# Altium project Room04.PrjPCB
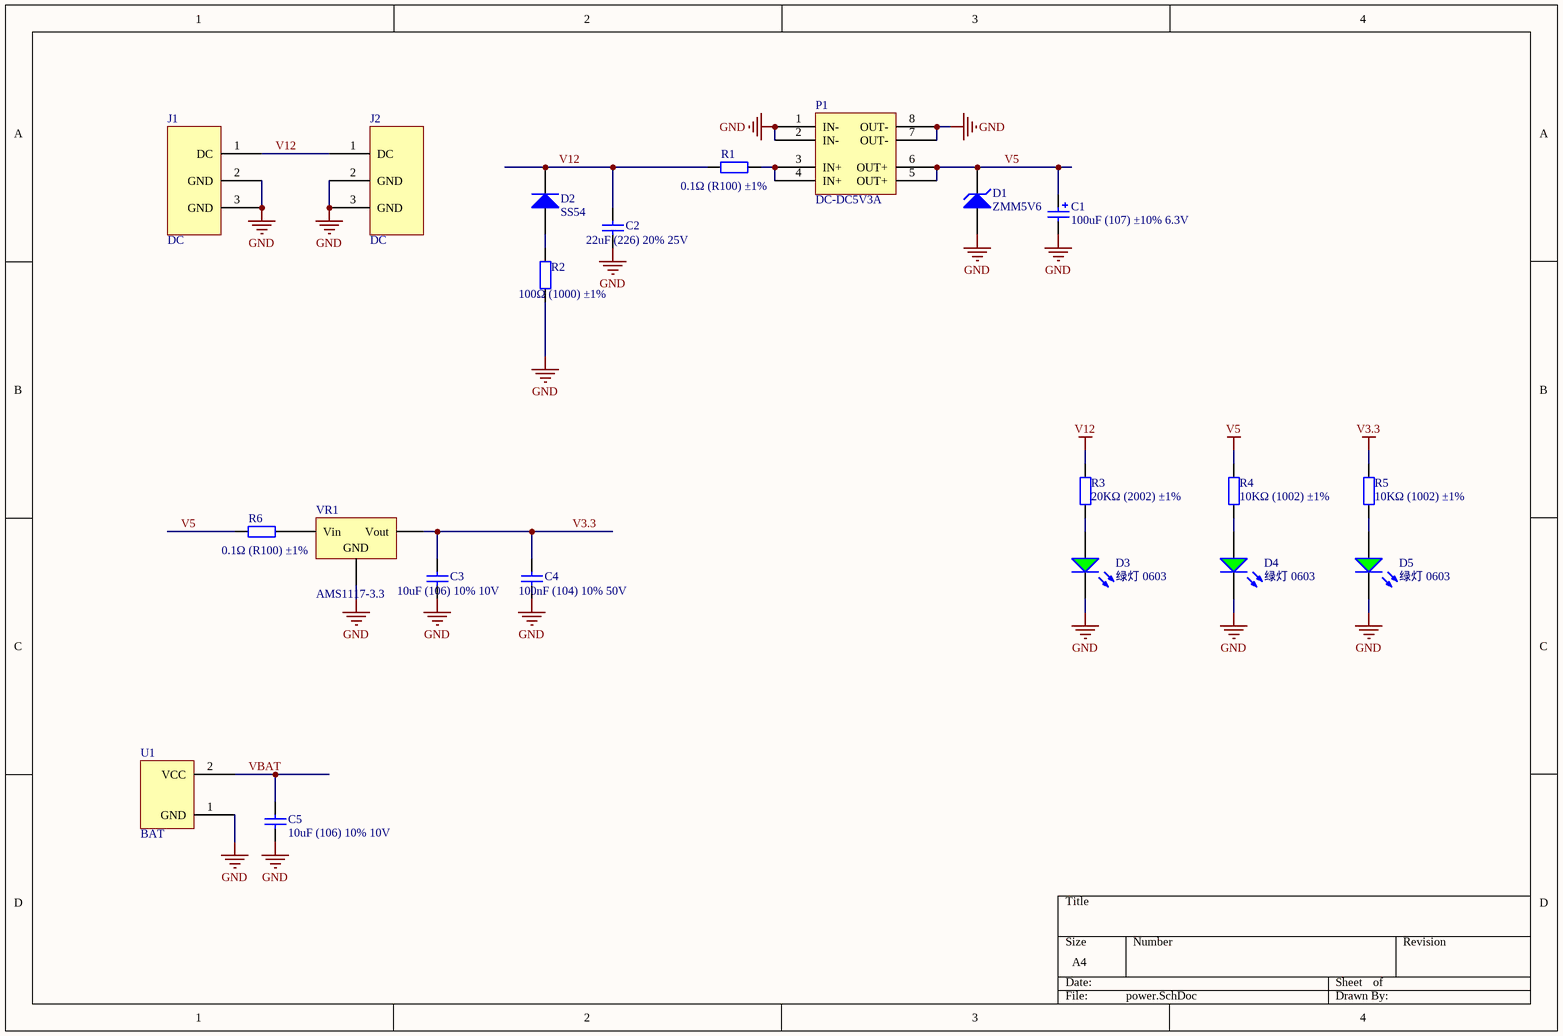
[diagram p0: power.SchDoc]
5 sheets, 100 parts. Net scope: global (net labels, ports and power ports of the same name join across sheets).
Board file: Room04.PcbDoc
Sheets:
  power.SchDoc
  raspi.SchDoc
  commu.SchDoc
  mcu.SchDoc
  other.SchDoc

## Sheet power.SchDoc
size A4

### Parts
C1  100uF (107) ±10% 6.3V  [CASE-B_3528]
C2  22uF (226) 20% 25V  [0805_C]
C3  10uF (106) 10% 10V  [0603_C]
C4  100nF (104) 10% 50V  [0603_C]
C5  10uF (106) 10% 10V  [0603_C]
D1  ZMM5V6  [LL-34]
D2  SS54  [SMA(DO-214AC)_S1]
D3  绿灯 0603  [0603_LED_S1]
D4  绿灯 0603  [0603_LED_S1]
D5  绿灯 0603  [0603_LED_S1]
J1  DC  [DC005]
J2  DC  [DC005]
P1  DC-DC5V3A  [DC-DC3A]
R1  0.1Ω (R100) ±1%  [1206_R]
R2  100Ω (1000) ±1%  [0805_R]
R3  20KΩ (2002) ±1%  [0603_R]
R4  10KΩ (1002) ±1%  [0603_R]
R5  10KΩ (1002) ±1%  [0603_R]
R6  0.1Ω (R100) ±1%  [1206_R]
U1  BAT  [BAT2032]
VR1  AMS1117-3.3  [SOT-223]

### Nets
GND: C1.2 C2.1 C3.1 C4.1 C5.1 D1.1(A) D3.K D4.K D5.K J1.2(GND) J1.3(GND) J2.2(GND) J2.3(GND) P1.1(IN-) P1.2(IN-) P1.7(OUT-) P1.8(OUT-) R2.1 U1.1(GND) VR1.1(GND)
V3.3: C3.2 C4.2 R5.2 VR1.2(Vout)
V5: C1.1 D1.2(K) P1.5(OUT+) P1.6(OUT+) R4.2 R6.1
V12: C2.2 D2.2(K) J1.1(DC) J2.1(DC) R1.1 R3.2
VBAT: C5.2 U1.2(VCC)
NetD2_1: D2.1(A) R2.2
NetD3_A: D3.A R3.1
NetD4_A: D4.A R4.1
NetD5_A: D5.A R5.1
NetP1_3: P1.3(IN+) P1.4(IN+) R1.2
NetR6_2: R6.2 VR1.3(Vin)

### Library data of the parts
C1 = 3528 100uF (107) 10% 6.3V: 钽电容; ComponentLink1Description: 供应商链接; ComponentLink1URL: http://www.szlcsc.com/product/details_16815.html; Package: 3528; Supplier: LC; SuppliersPartNumber: C16133
C2 = 0805 22uF (226) 20% 25V: 贴片电容; ComponentLink1Description: 供应商链接; ComponentLink1URL: http://www.szlcsc.com/product/details_46786.html; Package: 0805; Supplier: LC; SuppliersPartNumber: C45783
C3 C5 = 0603 10uF (106) 10% 10V: 贴片电容; ComponentLink1Description: 供应商链接; ComponentLink1URL: http://www.szlcsc.com/product/details_20411.html; Package: 0603; Supplier: LC; SuppliersPartNumber: C19702
C4 = 0603 100nF (104) 10% 50V: 贴片电容; ComponentLink1Description: 供应商链接; ComponentLink1URL: http://www.szlcsc.com/product/details_15331.html; Package: 0603; Supplier: LC; SuppliersPartNumber: C14663
D1 = LL-34 ZMM5V6: 稳压二极管; ComponentLink1Description: 供应商链接; ComponentLink1URL: http://www.szlcsc.com/product/details_8541.html; Package: LL-34; Supplier: LC; SuppliersPartNumber: C8062
D2 = SMA(DO-214AC) SS54: 二极管; ComponentLink1Description: 供应商链接; ComponentLink1URL: http://www.szlcsc.com/product/details_23178.html; Package: SMA(DO-214AC); Supplier: LC; SuppliersPartNumber: C22452
D3-D5 = 0603 绿灯: 发光二极管; ComponentLink1Description: 供应商链接; ComponentLink1URL: http://www.szlcsc.com/product/details_73152.html; Package: 0603; Supplier: LC; SuppliersPartNumber: C72043
J1 J2 = DC: Connector for DC 12V
P1 = DC-DC3A
R1 R6 = 1206 0.1Ω (R100) 1%: 贴片电阻; ComponentLink1Description: 供应商链接; ComponentLink1URL: http://www.szlcsc.com/product/details_26077.html; Package: 1206; Supplier: LC; SuppliersPartNumber: C25334
R2 = 0805 100Ω (1000) 1%: 贴片电阻; ComponentLink1Description: 供应商链接; ComponentLink1URL: http://www.szlcsc.com/product/details_18096.html; Package: 0805; Supplier: LC; SuppliersPartNumber: C17408
R3 = 0603 20KΩ (2002) 1%: 贴片电阻; ComponentLink1Description: 供应商链接; ComponentLink1URL: http://www.szlcsc.com/product/details_4591.html; Package: 0603; Supplier: LC; SuppliersPartNumber: C4184
R4 R5 = 0603 10KΩ (1002) 1%: 贴片电阻; ComponentLink1Description: 供应商链接; ComponentLink1URL: http://www.szlcsc.com/product/details_26547.html; Package: 0603; Supplier: LC; SuppliersPartNumber: C25804
U1 = BAT2032
VR1 = SOT-223 AMS1117-3.3: 低压差线性稳压(LDO); ComponentLink1Description: 供应商链接; ComponentLink1URL: http://www.szlcsc.com/product/details_6652.html; Package: SOT-223; Supplier: LC; SuppliersPartNumber: C6186

## Sheet raspi.SchDoc
size A4
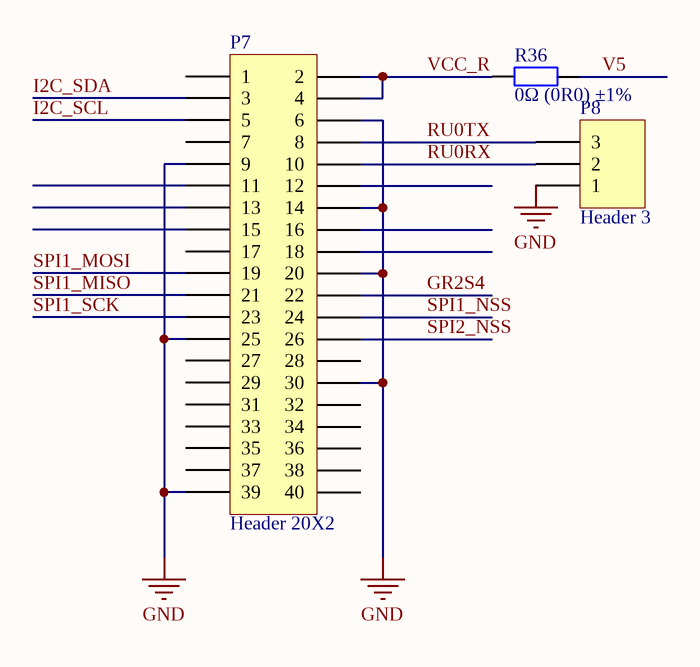
[diagram p1: raspi.SchDoc]

### Parts
P7  Header 20X2  [HDR2X20]
P8  Header 3  [HDR1X3]
R36  0Ω (0R0) ±1%  [1206_R]

### Nets
GND: P7.6 P7.9 P7.14 P7.20 P7.25 P7.30 P7.39 P8.1
V5: R36.2
GR2S4: P7.22
I2C_SCL: P7.5
I2C_SDA: P7.3
RU0RX: P7.10 P8.2
RU0TX: P7.8 P8.3
SPI1_MISO: P7.21
SPI1_MOSI: P7.19
SPI1_NSS: P7.24
SPI1_SCK: P7.23
SPI2_NSS: P7.26
VCC_R: P7.2 P7.4 R36.1

Not connected (* = marked no-connect by the designer): P7 1 7 11 12 13 15 16 17 18 27 28 29 31 32 33 34 35 36 37 38 40

### Library data of the parts
P7 = Header 20X2: Header, 20-Pin, Dual row; LatestRevisionDate: 17-Jul-2002; LatestRevisionNote: Re-released for DXP Platform.; Publisher: Altium Limited
P8 = Header 3: Header, 3-Pin; LatestRevisionDate: 17-Jul-2002; LatestRevisionNote: Re-released for DXP Platform.; Publisher: Altium Limited
R36 = 1206 0Ω (0R0) 1%: 贴片电阻; ComponentLink1Description: 供应商链接; ComponentLink1URL: http://www.szlcsc.com/product/details_18576.html; Package: 1206; Supplier: LC; SuppliersPartNumber: C17888

## Sheet commu.SchDoc
size A4
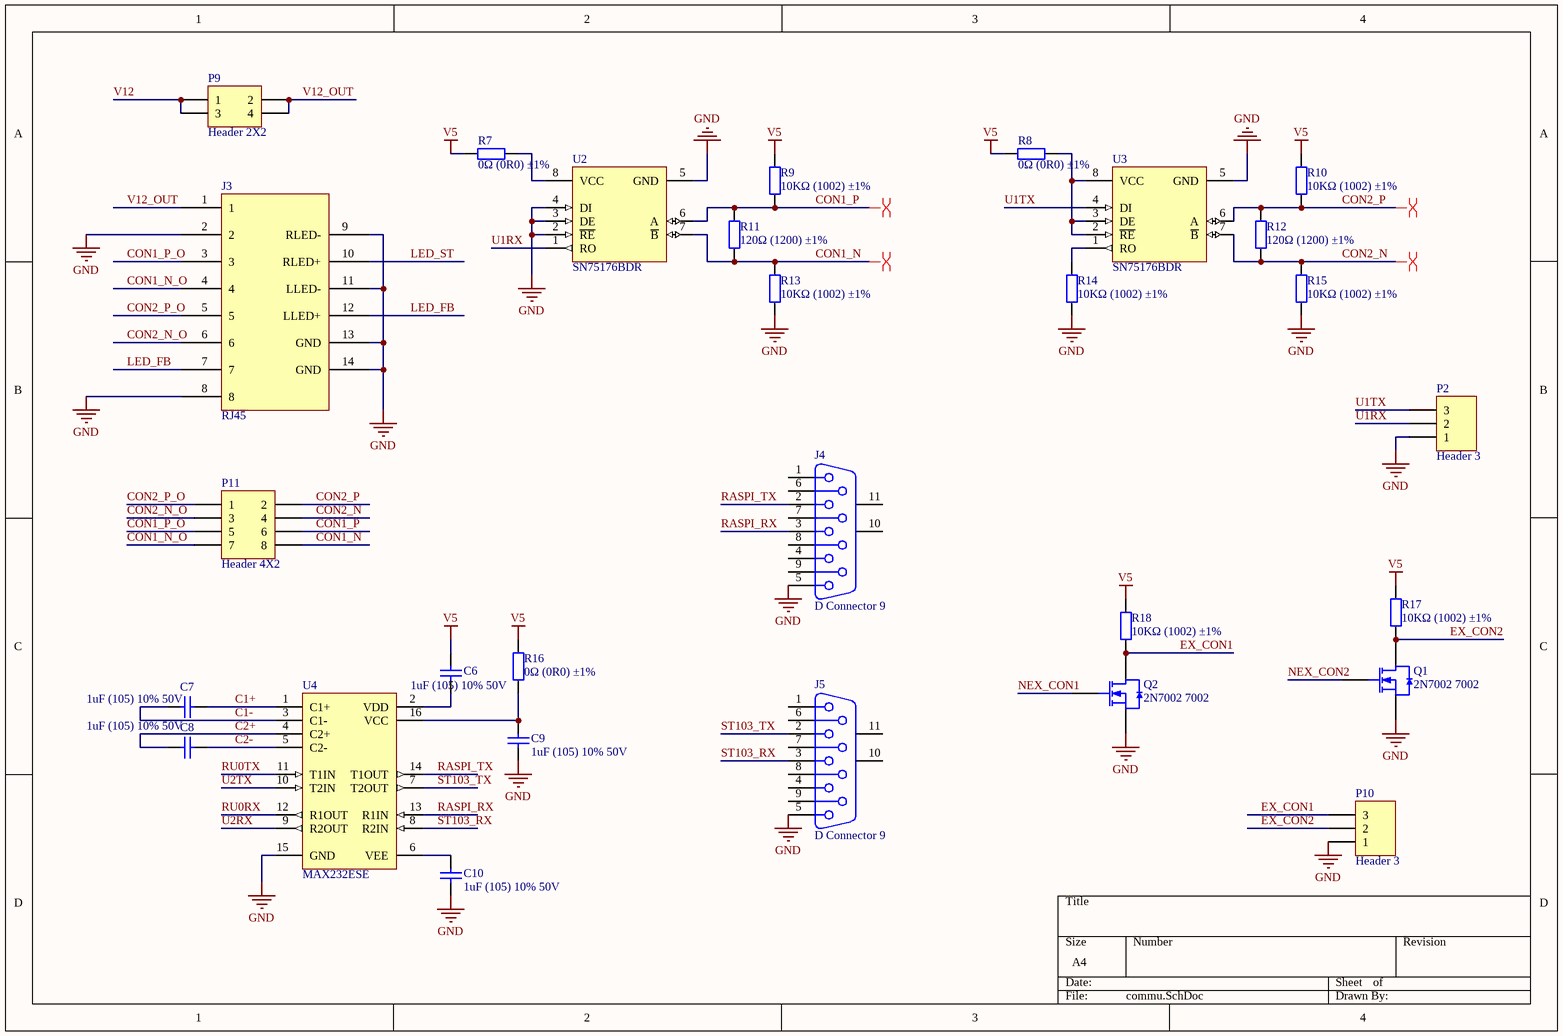
[diagram p2: commu.SchDoc]

### Parts
C6  1uF (105) 10% 50V  [0603_C]
C7  1uF (105) 10% 50V  [0603_C]
C8  1uF (105) 10% 50V  [0603_C]
C9  1uF (105) 10% 50V  [0603_C]
C10  1uF (105) 10% 50V  [0603_C]
J3  RJ45  [RJ45_1]
J4  D Connector 9  [DSUB1.385-2H9]
J5  D Connector 9  [DSUB1.385-2H9]
P2  Header 3  [HDR1X3]
P9  Header 2X2  [HDR2X2]
P10  Header 3  [HDR1X3]
P11  Header 4X2  [HDR2X4]
Q1  2N7002 7002  [SOT-23(SOT-23-3)]
Q2  2N7002 7002  [SOT-23(SOT-23-3)]
R7  0Ω (0R0) ±1%  [1206_R]
R8  0Ω (0R0) ±1%  [1206_R]
R9  10KΩ (1002) ±1%  [0603_R]
R10  10KΩ (1002) ±1%  [0603_R]
R11  120Ω (1200) ±1%  [0603_R]
R12  120Ω (1200) ±1%  [0603_R]
R13  10KΩ (1002) ±1%  [0603_R]
R14  10KΩ (1002) ±1%  [0603_R]
R15  10KΩ (1002) ±1%  [0603_R]
R16  0Ω (0R0) ±1%  [1206_R]
R17  10KΩ (1002) ±1%  [0603_R]
R18  10KΩ (1002) ±1%  [0603_R]
U2  SN75176BDR  [SOIC-8_150mil]
U3  SN75176BDR  [SOIC-8_150mil]
U4  MAX232ESE  [SOIC-16_150mil]

### Nets
GND: C9.1 C10.1 J3.2 J3.8 J3.9(RLED-) J3.11(LLED-) J3.13(GND) J3.14(GND) J4.5 J5.5 P2.1 P10.1 Q1.2(S) Q2.2(S) R13.1 R14.1 R15.1 U2.2(~{RE}) U2.3(DE) U2.4(DI) U2.5(GND) U3.5(GND) U4.15(GND)
V5: C6.2 R7.1 R8.1 R9.2 R10.2 R16.2 R17.2 R18.2
V12: P9.1 P9.3
C1+: C7.2 U4.1(C1+)
C1-: C7.1 U4.3(C1-)
C2+: C8.1 U4.4(C2+)
C2-: C8.2 U4.5(C2-)
CON1_N: P11.8 R11.1 R13.2 U2.7(~{B})
CON1_N_O: J3.4 P11.7
CON1_P: P11.6 R9.1 R11.2 U2.6(A)
CON1_P_O: J3.3 P11.5
CON2_N: P11.4 R12.1 R15.2 U3.7(~{B})
CON2_N_O: J3.6 P11.3
CON2_P: P11.2 R10.1 R12.2 U3.6(A)
CON2_P_O: J3.5 P11.1
EX_CON1: P10.3 Q2.3(D) R18.1
EX_CON2: P10.2 Q1.3(D) R17.1
LED_FB: J3.7 J3.12(LLED+)
LED_ST: J3.10(RLED+)
NEX_CON1: Q2.1(G)
NEX_CON2: Q1.1(G)
RASPI_RX: J4.3 U4.13(R1IN)
RASPI_TX: J4.2 U4.14(T1OUT)
RU0RX: U4.12(R1OUT)
RU0TX: U4.11(T1IN)
ST103_RX: J5.3 U4.8(R2IN)
ST103_TX: J5.2 U4.7(T2OUT)
U1RX: P2.2 U2.1(RO)
U1TX: P2.3 U3.4(DI)
U2RX: U4.9(R2OUT)
U2TX: U4.10(T2IN)
V12_OUT: J3.1 P9.2 P9.4
NetC6_1: C6.1 U4.2(VDD)
NetC9_2: C9.2 R16.1 U4.16(VCC)
NetC10_2: C10.2 U4.6(VEE)
NetR7_2: R7.2 U2.8(VCC)
NetR8_2: R8.2 U3.2(~{RE}) U3.3(DE) U3.8(VCC)
NetR14_2: R14.2 U3.1(RO)

Not connected (* = marked no-connect by the designer): J4 1 4 6 7 8 9 10(MH1) 11(MH2); J5 1 4 6 7 8 9 10(MH1) 11(MH2)

### Layout directives
differential pair: CON1_N, CON1_P, CON2_N, CON2_P

### Library data of the parts
C6-C10 = 0603 1uF (105) 10% 50V: 贴片电容; ComponentLink1Description: 供应商链接; ComponentLink1URL: http://www.szlcsc.com/product/details_16531.html; Package: 0603; Supplier: LC; SuppliersPartNumber: C15849
J3 = RJ45_1
J4 J5 = D Connector 9: Receptacle Assembly, 9 Position, Right Angle; PackageDocument: O; Positions: 9; Published: 15-Jun-2001; LatestRevisionDate: 17-Jul-2002; LatestRevisionNote: Re-released for DXP Platform.; DatasheetDocument: 1-Sep-1999; PackageReference: 788750; Publisher: Altium Limited; Orientation: Right Angle; Gender: Receptacle
P2 P10 = Header 3: Header, 3-Pin; LatestRevisionDate: 17-Jul-2002; LatestRevisionNote: Re-released for DXP Platform.; Publisher: Altium Limited
P9 = Header 2X2: Header, 2-Pin, Dual row; LatestRevisionDate: 17-Jul-2002; LatestRevisionNote: Re-released for DXP Platform.; Publisher: Altium Limited
P11 = Header 4X2: Header, 4-Pin, Dual row; LatestRevisionDate: 17-Jul-2002; LatestRevisionNote: Re-released for DXP Platform.; Publisher: Altium Limited
Q1 Q2 = 2N7002 7002: MOS(场效应管); ComponentLink1Description: 供应商链接; ComponentLink1URL: http://www.szlcsc.com/product/details_9040.html; Package: SOT-23(SOT-23-3); Supplier: LC; SuppliersPartNumber: C8545
R7 R8 R16 = 1206 0Ω (0R0) 1%: 贴片电阻; ComponentLink1Description: 供应商链接; ComponentLink1URL: http://www.szlcsc.com/product/details_18576.html; Package: 1206; Supplier: LC; SuppliersPartNumber: C17888
R9 R10 R13-R15 R17 R18 = 0603 10KΩ (1002) 1%: 贴片电阻; ComponentLink1Description: 供应商链接; ComponentLink1URL: http://www.szlcsc.com/product/details_26547.html; Package: 0603; Supplier: LC; SuppliersPartNumber: C25804
R11 R12 = 0603 120Ω (1200) 1%: 贴片电阻; ComponentLink1Description: 供应商链接; ComponentLink1URL: http://www.szlcsc.com/product/details_23514.html; Package: 0603; Supplier: LC; SuppliersPartNumber: C22787
U2 U3 = SN75176BDR_[C7063]: RS-485/RS-422; ComponentLink1Description: 供应商链接; ComponentLink1URL: http://www.szlcsc.com/product/details_7535.html; Package: SOIC-8_150mil; Supplier: LC; SuppliersPartNumber: C7063
U4 = MAX232ESE_[C26860]: RS232; ComponentLink1Description: 供应商链接; ComponentLink1URL: http://www.szlcsc.com/product/details_27608.html; Package: SOIC-16_150mil; Supplier: LC; SuppliersPartNumber: C26860

## Sheet mcu.SchDoc
size A4
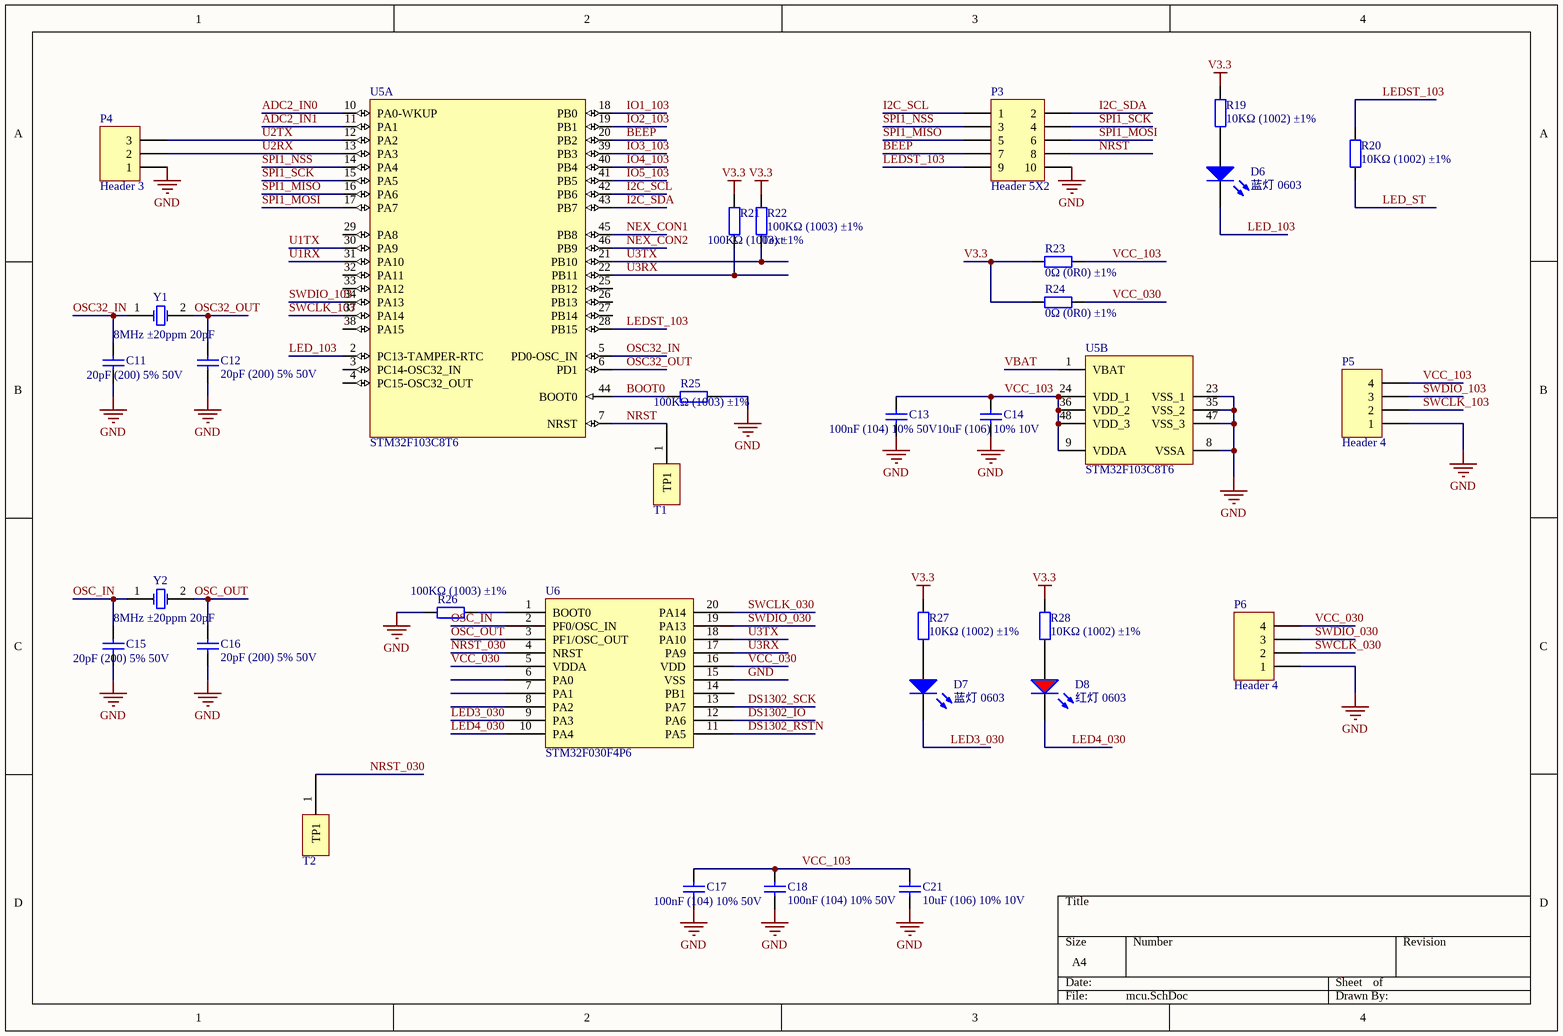
[diagram p3: mcu.SchDoc]

### Parts
C11  20pF (200) 5% 50V  [0603_C]
C12  20pF (200) 5% 50V  [0603_C]
C13  100nF (104) 10% 50V  [0603_C]
C14  10uF (106) 10% 10V  [0603_C]
C15  20pF (200) 5% 50V  [0603_C]
C16  20pF (200) 5% 50V  [0603_C]
C17  100nF (104) 10% 50V  [1206_C]
C18  100nF (104) 10% 50V  [1206_C]
C21  10uF (106) 10% 10V  [0603_C]
D6  蓝灯 0603  [0603_LED_S1]
D7  蓝灯 0603  [0603_LED_S1]
D8  红灯 0603  [0603_LED_S1]
P3  Header 5X2  [HDR2X5]
P4  Header 3  [HDR1X3]
P5  Header 4  [HDR1X4]
P6  Header 4  [HDR1X4]
R19  10KΩ (1002) ±1%  [0603_R]
R20  10KΩ (1002) ±1%  [0603_R]
R21  100KΩ (1003) ±1%  [0603_R]
R22  100KΩ (1003) ±1%  [0603_R]
R23  0Ω (0R0) ±1%  [1206_R]
R24  0Ω (0R0) ±1%  [1206_R]
R25  100KΩ (1003) ±1%  [0603_R]
R26  100KΩ (1003) ±1%  [0603_R]
R27  10KΩ (1002) ±1%  [0603_R]
R28  10KΩ (1002) ±1%  [0603_R]
T1  TP1  [TP1]  (value not drawn)
T2  TP1  [TP1]  (value not drawn)
U5  STM32F103C8T6  [LQFP-48_7x7x05P]  (parts A,B of 2)
U6  STM32F030F4P6  [TSSOP-20]
Y1  8MHz ±20ppm 20pF  [SMD-5032_2P]
Y2  8MHz ±20ppm 20pF  [SMD-5032_2P]

### Nets
GND: C11.1 C12.1 C13.1 C14.2 C15.1 C16.1 C17.1 C18.1 C21.2 P3.10 P4.1 P5.1 P6.1 R25.2 R26.1 U5.8(VSSA) U5.23(VSS_1) U5.35(VSS_2) U5.47(VSS_3) U6.15(VSS)
V3.3: R19.2 R21.2 R22.2 R23.1 R24.1 R27.2 R28.2
VCC_103: C13.2 C14.1 C17.2 C18.2 C21.1 P5.4 R23.2 U5.9(VDDA) U5.24(VDD_1) U5.36(VDD_2) U5.48(VDD_3)
ADC2_IN0: U5.10(PA0-WKUP)
ADC2_IN1: U5.11(PA1)
BEEP: P3.7 U5.20(PB2)
BOOT0: R25.1 U5.44(BOOT0)
DS1302_IO: U6.12(PA6)
DS1302_RSTN: U6.11(PA5)
DS1302_SCK: U6.13(PA7)
I2C_SCL: P3.1 U5.42(PB6)
I2C_SDA: P3.2 U5.43(PB7)
IO1_103: U5.18(PB0)
IO2_103: U5.19(PB1)
IO3_103: U5.39(PB3)
IO4_103: U5.40(PB4)
IO5_103: U5.41(PB5)
LED3_030: D7.K U6.9(PA3)
LED4_030: D8.K U6.10(PA4)
LED_103: D6.K U5.2(PC13-TAMPER-RTC)
LED_ST: R20.1
LEDST_103: P3.9 R20.2 U5.28(PB15)
NEX_CON1: U5.45(PB8)
NEX_CON2: U5.46(PB9)
NRST: P3.8 T1.1(TP1) U5.7(NRST)
NRST_030: T2.1(TP1) U6.4(NRST)
OSC32_IN: C11.2 U5.5(PD0-OSC_IN) Y1.1(OSC1)
OSC32_OUT: C12.2 U5.6(PD1) Y1.2(OSC2)
OSC_IN: C15.2 U6.2(PF0/OSC_IN) Y2.1(OSC1)
OSC_OUT: C16.2 U6.3(PF1/OSC_OUT) Y2.2(OSC2)
SPI1_MISO: P3.5 U5.16(PA6)
SPI1_MOSI: P3.6 U5.17(PA7)
SPI1_NSS: P3.3 U5.14(PA4)
SPI1_SCK: P3.4 U5.15(PA5)
SWCLK_030: P6.2 U6.20(PA14)
SWCLK_103: P5.2 U5.37(PA14)
SWDIO_030: P6.3 U6.19(PA13)
SWDIO_103: P5.3 U5.34(PA13)
U1RX: U5.31(PA10)
U1TX: U5.30(PA9)
U2RX: P4.2 U5.13(PA3)
U2TX: P4.3 U5.12(PA2)
U3RX: R21.1 U5.22(PB11) U6.17(PA9)
U3TX: R22.1 U5.21(PB10) U6.18(PA10)
VBAT: U5.1(VBAT)
VCC_030: P6.4 R24.2 U6.5(VDDA) U6.16(VDD)
NetD6_A: D6.A R19.1
NetD7_A: D7.A R27.1
NetD8_A: D8.A R28.1
NetR26_2: R26.2 U6.1(BOOT0)

Not connected (* = marked no-connect by the designer): U5 3(PC14-OSC32_IN) 4(PC15-OSC32_OUT) 25(PB12) 26(PB13) 27(PB14) 29(PA8) 32(PA11) 33(PA12) 38(PA15); U6 6(PA0) 7(PA1) 8(PA2) 14(PB1)

### Notes on the sheet
- (near R22) Text

### Library data of the parts
C11 C12 C15 C16 = 0603 20pF (200) 5% 50V: 贴片电容; ComponentLink1Description: 供应商链接; ComponentLink1URL: http://www.szlcsc.com/product/details_2000.html; Package: 0603; Supplier: LC; SuppliersPartNumber: C1648
C13 = 0603 100nF (104) 10% 50V: 贴片电容; ComponentLink1Description: 供应商链接; ComponentLink1URL: http://www.szlcsc.com/product/details_15331.html; Package: 0603; Supplier: LC; SuppliersPartNumber: C14663
C14 C21 = 0603 10uF (106) 10% 10V: 贴片电容; ComponentLink1Description: 供应商链接; ComponentLink1URL: http://www.szlcsc.com/product/details_20411.html; Package: 0603; Supplier: LC; SuppliersPartNumber: C19702
C17 C18 = 1206 100nF (104) 10% 50V: 贴片电容; ComponentLink1Description: 供应商链接; ComponentLink1URL: http://www.szlcsc.com/product/details_25237.html; Package: 1206; Supplier: LC; SuppliersPartNumber: C24497
D6 D7 = 0603 蓝灯: 发光二极管; ComponentLink1Description: 供应商链接; ComponentLink1URL: http://www.szlcsc.com/product/details_73150.html; Package: 0603; Supplier: LC; SuppliersPartNumber: C72041
D8 = 0603 红灯: 发光二极管; ComponentLink1Description: 供应商链接; ComponentLink1URL: http://www.szlcsc.com/product/details_2659.html; Package: 0603; Supplier: LC; SuppliersPartNumber: C2286
P3 = Header 5X2: Header, 5-Pin, Dual row; LatestRevisionDate: 17-Jul-2002; LatestRevisionNote: Re-released for DXP Platform.; Publisher: Altium Limited
P4 = Header 3: Header, 3-Pin; LatestRevisionDate: 17-Jul-2002; LatestRevisionNote: Re-released for DXP Platform.; Publisher: Altium Limited
P5 P6 = Header 4: Header, 4-Pin; LatestRevisionDate: 17-Jul-2002; LatestRevisionNote: Re-released for DXP Platform.; Publisher: Altium Limited
R19 R20 R27 R28 = 0603 10KΩ (1002) 1%: 贴片电阻; ComponentLink1Description: 供应商链接; ComponentLink1URL: http://www.szlcsc.com/product/details_26547.html; Package: 0603; Supplier: LC; SuppliersPartNumber: C25804
R21 R22 R25 R26 = 0603 100KΩ (1003) 1%: 贴片电阻; ComponentLink1Description: 供应商链接; ComponentLink1URL: http://www.szlcsc.com/product/details_26546.html; Package: 0603; Supplier: LC; SuppliersPartNumber: C25803
R23 R24 = 1206 0Ω (0R0) 1%: 贴片电阻; ComponentLink1Description: 供应商链接; ComponentLink1URL: http://www.szlcsc.com/product/details_18576.html; Package: 1206; Supplier: LC; SuppliersPartNumber: C17888
U5 = STM32F103C8T6: ARM; ComponentLink1Description: 供应商链接; ComponentLink1URL: http://www.szlcsc.com/product/details_9243.html; Package: LQFP-48_7x7x05P; Supplier: LC; SuppliersPartNumber: C8734
U6 = STM32F030F4P6: ARM; ComponentLink1Description: 供应商链接; ComponentLink1URL: http://www.szlcsc.com/product/details_33873.html; Package: TSSOP-20; Supplier: LC; SuppliersPartNumber: C32908
Y1 Y2 = SMD-5032_2P 8MHz 20ppm 20pF: 贴片晶振; ComponentLink1Description: 供应商链接; ComponentLink1URL: http://www.szlcsc.com/product/details_117214.html; Package: SMD-5032_2P; Supplier: LC; SuppliersPartNumber: C115962

## Sheet other.SchDoc
size A4
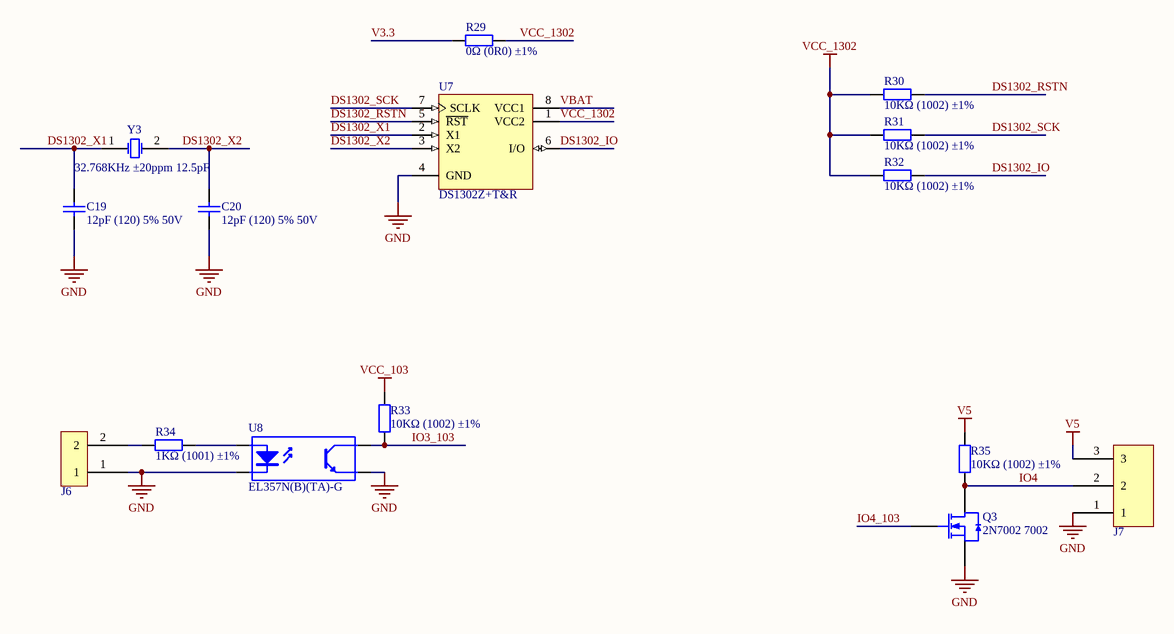
[diagram p4: other.SchDoc]

### Parts
C19  12pF (120) 5% 50V  [0603_C]
C20  12pF (120) 5% 50V  [0603_C]
J6  KF301-2P  [KF301-2P]  (value not drawn)
J7  KF301-3P  [KF301-3P]  (value not drawn)
Q3  2N7002 7002  [SOT-23(SOT-23-3)]
R29  0Ω (0R0) ±1%  [1206_R]
R30  10KΩ (1002) ±1%  [0603_R]
R31  10KΩ (1002) ±1%  [0603_R]
R32  10KΩ (1002) ±1%  [0603_R]
R33  10KΩ (1002) ±1%  [1206_R]
R34  1KΩ (1001) ±1%  [1206_R]
R35  10KΩ (1002) ±1%  [1206_R]
U7  DS1302Z+T&R  [SOIC-8_150mil]
U8  EL357N(B)(TA)-G  [SOP-4_P2.54]
Y3  32.768KHz ±20ppm 12.5pF  [SMD-3215_2P FC - 135]

### Nets
GND: C19.1 C20.1 J6.1 J7.1 Q3.2(S) U7.4(GND) U8.2(K) U8.3(E)
V3.3: R29.1
V5: J7.3 R35.2
VCC_103: R33.2
VCC_1302: R29.2 R30.1 R31.1 R32.1 U7.1(VCC2)
DS1302_IO: R32.2 U7.6(I/O)
DS1302_RSTN: R30.2 U7.5(~{RST})
DS1302_SCK: R31.2 U7.7(SCLK)
DS1302_X1: C19.2 U7.2(X1) Y3.1(OSC1)
DS1302_X2: C20.2 U7.3(X2) Y3.2(OSC2)
IO3_103: R33.1 U8.4(C)
IO4: J7.2 Q3.3(D) R35.1
IO4_103: Q3.1(G)
VBAT: U7.8(VCC1)
NetJ6_2: J6.2 R34.1
NetR34_2: R34.2 U8.1(A)

### Library data of the parts
C19 C20 = 0603 12pF (120) 5% 50V: 贴片电容; ComponentLink1Description: 供应商链接; ComponentLink1URL: http://www.szlcsc.com/product/details_39506.html; Package: 0603; Supplier: LC; SuppliersPartNumber: C38523
Q3 = 2N7002 7002: MOS(场效应管); ComponentLink1Description: 供应商链接; ComponentLink1URL: http://www.szlcsc.com/product/details_9040.html; Package: SOT-23(SOT-23-3); Supplier: LC; SuppliersPartNumber: C8545
R29 = 1206 0Ω (0R0) 1%: 贴片电阻; ComponentLink1Description: 供应商链接; ComponentLink1URL: http://www.szlcsc.com/product/details_18576.html; Package: 1206; Supplier: LC; SuppliersPartNumber: C17888
R30-R32 = 0603 10KΩ (1002) 1%: 贴片电阻; ComponentLink1Description: 供应商链接; ComponentLink1URL: http://www.szlcsc.com/product/details_26547.html; Package: 0603; Supplier: LC; SuppliersPartNumber: C25804
R33 R35 = 1206 10KΩ (1002) 1%: 贴片电阻; ComponentLink1Description: 供应商链接; ComponentLink1URL: http://www.szlcsc.com/product/details_18590.html; Package: 1206; Supplier: LC; SuppliersPartNumber: C17902
R34 = 1206 1KΩ (1001) 1%: 贴片电阻; ComponentLink1Description: 供应商链接; ComponentLink1URL: http://www.szlcsc.com/product/details_4817.html; Package: 1206; Supplier: LC; SuppliersPartNumber: C4410
U7 = DS1302Z+T&R_[C8959]: 实时时钟; ComponentLink1Description: 供应商链接; ComponentLink1URL: http://www.szlcsc.com/product/details_9478.html; Package: SOIC-8_150mil; Supplier: LC; SuppliersPartNumber: C8959
U8 = EL357N(B)(TA)-G_[C6649]: 贴片光耦; ComponentLink1Description: 供应商链接; ComponentLink1URL: http://www.szlcsc.com/product/details_7114.html; Package: SOP-4_P2.54; Supplier: LC; SuppliersPartNumber: C6649
Y3 = SMD-3215_2P 32.768KHz 20ppm 12.5pF: 贴片晶振; ComponentLink1Description: 供应商链接; ComponentLink1URL: http://www.szlcsc.com/product/details_33310.html; Package: SMD-3215_2P; Supplier: LC; SuppliersPartNumber: C32346

## Nets that join several sheets
GND: power (20 pins), raspi (8 pins), commu (23 pins), mcu (20 pins), other (8 pins)
V3.3: power (C3.2 C4.2 R5.2 VR1.2), mcu (7 pins), other (R29.1)
V5: power (6 pins), raspi (R36.2), commu (8 pins), other (J7.3 R35.2)
V12: power (6 pins), commu (P9.1 P9.3)
VCC_103: mcu (11 pins), other (R33.2)
DS1302_IO: mcu (U6.12), other (R32.2 U7.6)
DS1302_RSTN: mcu (U6.11), other (R30.2 U7.5)
DS1302_SCK: mcu (U6.13), other (R31.2 U7.7)
I2C_SCL: raspi (P7.5), mcu (P3.1 U5.42)
I2C_SDA: raspi (P7.3), mcu (P3.2 U5.43)
IO3_103: mcu (U5.39), other (R33.1 U8.4)
IO4_103: mcu (U5.40), other (Q3.1)
LED_ST: commu (J3.10), mcu (R20.1)
NEX_CON1: commu (Q2.1), mcu (U5.45)
NEX_CON2: commu (Q1.1), mcu (U5.46)
RU0RX: raspi (P7.10 P8.2), commu (U4.12)
RU0TX: raspi (P7.8 P8.3), commu (U4.11)
SPI1_MISO: raspi (P7.21), mcu (P3.5 U5.16)
SPI1_MOSI: raspi (P7.19), mcu (P3.6 U5.17)
SPI1_NSS: raspi (P7.24), mcu (P3.3 U5.14)
SPI1_SCK: raspi (P7.23), mcu (P3.4 U5.15)
U1RX: commu (P2.2 U2.1), mcu (U5.31)
U1TX: commu (P2.3 U3.4), mcu (U5.30)
U2RX: commu (U4.9), mcu (P4.2 U5.13)
U2TX: commu (U4.10), mcu (P4.3 U5.12)
VBAT: power (C5.2 U1.2), mcu (U5.1), other (U7.8)